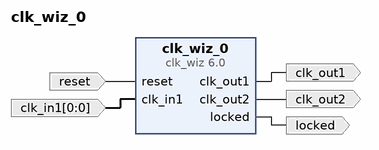
[diagram p0: block diagram of the top level]
# Vivado block design clk_wiz_0, xc7z010clg400-1, Vivado 2019.1
create_bd_design clk_wiz_0

create_bd_port -dir I -type rst reset
set_property -dict {CONFIG.POLARITY ACTIVE_HIGH} [get_bd_ports reset]
create_bd_port -dir O -type clk clk_out1
set_property -dict {CONFIG.FREQ_HZ 74218750} [get_bd_ports clk_out1]
create_bd_port -dir O locked
create_bd_port -dir O -type clk clk_out2
set_property -dict {CONFIG.FREQ_HZ 371093750} [get_bd_ports clk_out2]
create_bd_port -dir I -from 0 -to 0 -type clk clk_in1
set_property -dict {CONFIG.FREQ_HZ 50000000} [get_bd_ports clk_in1]

create_bd_cell -type ip -vlnv xilinx.com:ip:clk_wiz:6.0 clk_wiz_0
set_property -dict [list \
  CONFIG.CLKIN1_JITTER_PS 200.0 \
  CONFIG.CLKOUT1_JITTER 462.435 \
  CONFIG.CLKOUT1_PHASE_ERROR 610.813 \
  CONFIG.CLKOUT1_REQUESTED_OUT_FREQ 74.25 \
  CONFIG.CLKOUT2_JITTER 372.733 \
  CONFIG.CLKOUT2_PHASE_ERROR 610.813 \
  CONFIG.CLKOUT2_REQUESTED_OUT_FREQ 371.25 \
  CONFIG.CLKOUT2_USED true \
  CONFIG.MMCM_CLKFBOUT_MULT_F 59.375 \
  CONFIG.MMCM_CLKIN1_PERIOD 20.000 \
  CONFIG.MMCM_CLKIN2_PERIOD 10.0 \
  CONFIG.MMCM_CLKOUT0_DIVIDE_F 10.000 \
  CONFIG.MMCM_CLKOUT1_DIVIDE 2 \
  CONFIG.MMCM_DIVCLK_DIVIDE 4 \
  CONFIG.NUM_OUT_CLKS 2 \
  CONFIG.PRIM_IN_FREQ 50.000 \
] [get_bd_cells clk_wiz_0]

# ---- connections ----

connect_bd_net -net reset_0_1 [get_bd_ports reset] [get_bd_pins clk_wiz_0/reset]
connect_bd_net [get_bd_pins clk_wiz_0/clk_out1] [get_bd_ports clk_out1]
connect_bd_net [get_bd_pins clk_wiz_0/locked] [get_bd_ports locked]
connect_bd_net [get_bd_pins clk_wiz_0/clk_out2] [get_bd_ports clk_out2]
connect_bd_net -net clk_in1_1 [get_bd_ports clk_in1] [get_bd_pins clk_wiz_0/clk_in1]

validate_bd_design
save_bd_design
